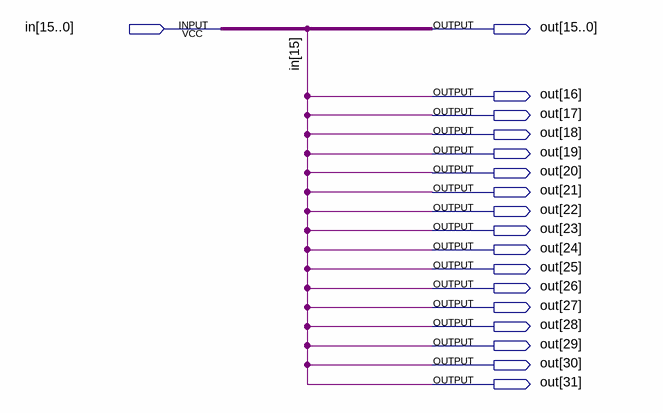
[diagram p0: schematic sheet]
// Quartus schematic sign extender.bdf as structural Verilog: 0 symbols, 18 pins
module \sign_extender  (
  input  [15:0] in,
  output [31:0] out
);


  assign out = {{17{in[15]}}, in[14:0]};
endmodule
